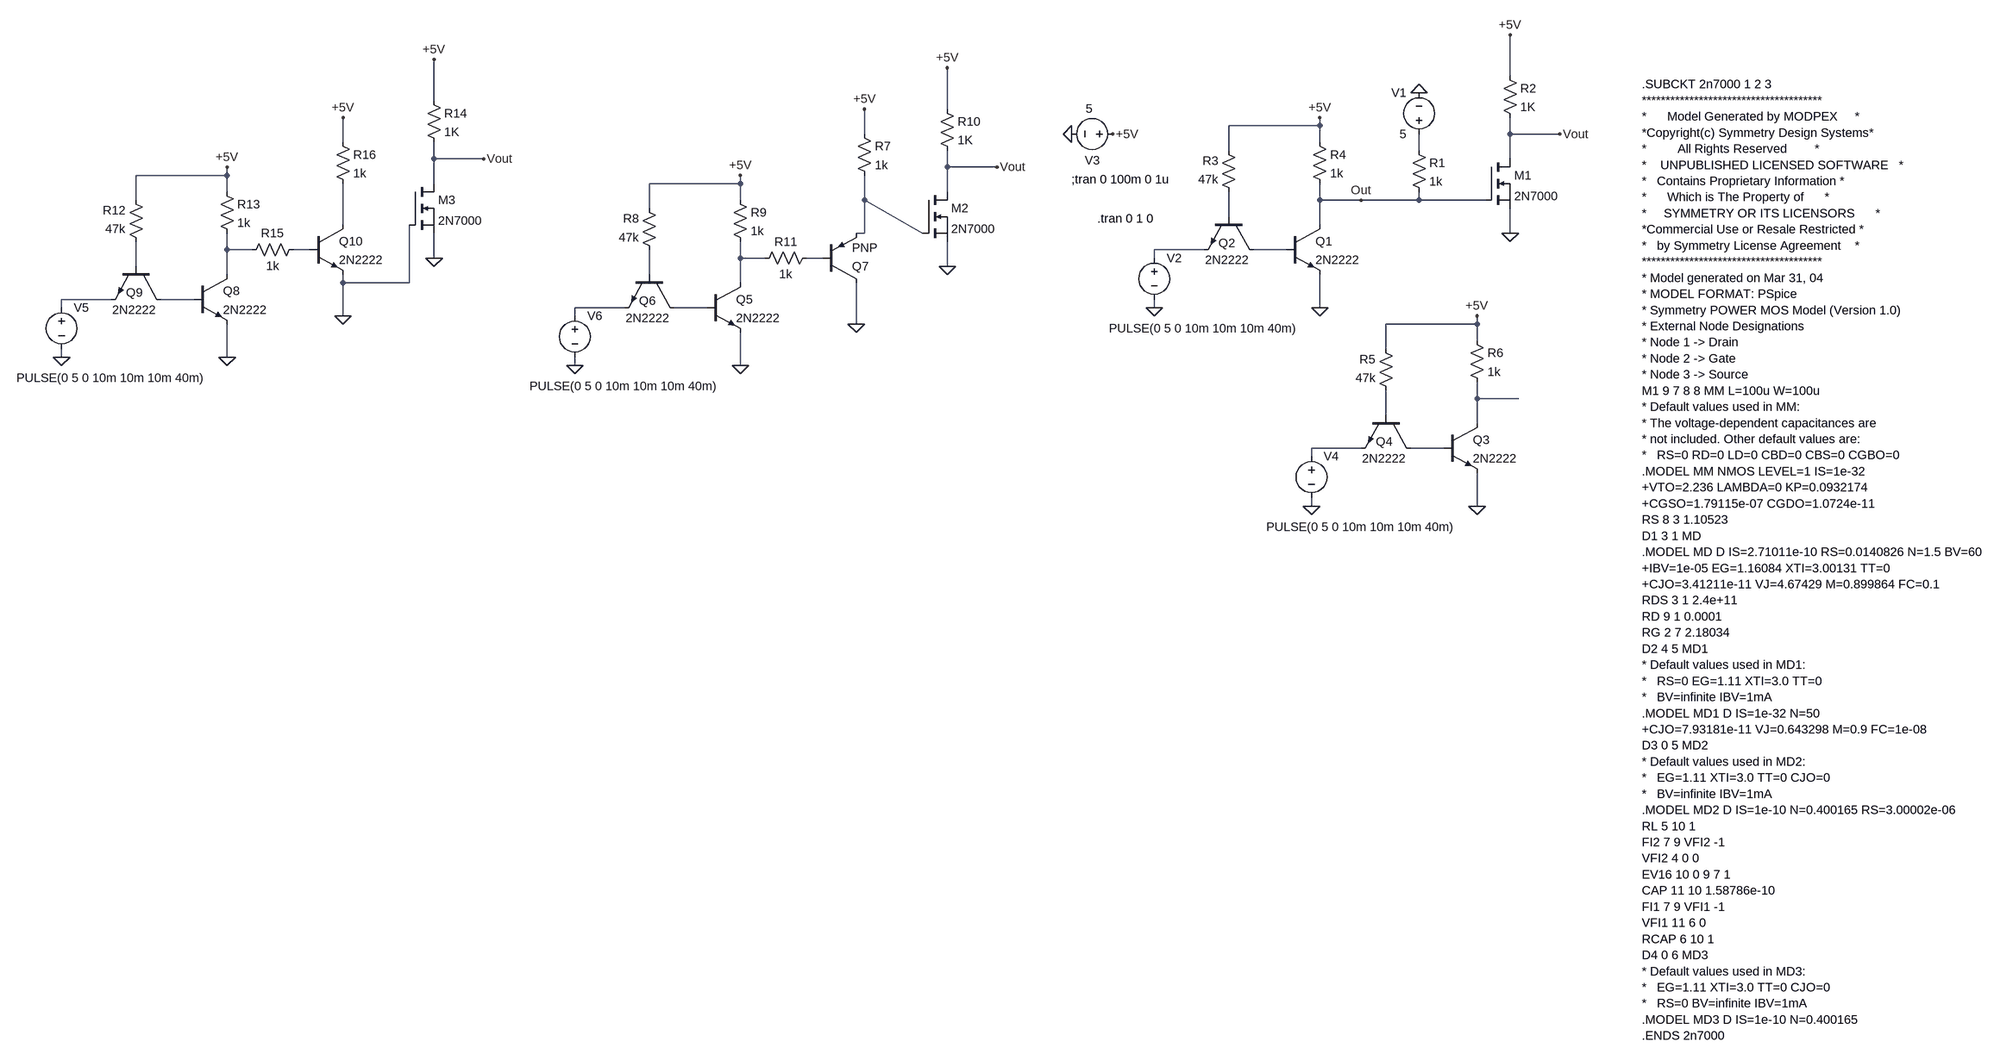
[diagram p0: schematic Soluciones.asc]
Soluciones.asc, the LTspice schematic file:
Version 4
SHEET 1 1320 1620
WIRE 336 -64 336 -144
WIRE -1744 -16 -1744 -96
WIRE -752 0 -752 -80
WIRE -32 32 -32 16
WIRE -32 32 -208 32
WIRE -912 48 -912 0
WIRE 336 48 336 16
WIRE 432 48 336 48
WIRE -1920 64 -1920 16
WIRE -32 64 -32 32
WIRE -208 80 -208 32
WIRE 160 80 160 48
WIRE -1744 96 -1744 64
WIRE -1648 96 -1744 96
WIRE 336 96 336 48
WIRE -752 112 -752 80
WIRE -656 112 -752 112
WIRE -2144 128 -2144 112
WIRE -2144 128 -2320 128
WIRE -1744 144 -1744 96
WIRE -1152 144 -1152 128
WIRE -1152 144 -1328 144
WIRE -2144 160 -2144 128
WIRE -752 160 -752 112
WIRE -2320 176 -2320 128
WIRE -1152 176 -1152 144
WIRE -912 176 -912 128
WIRE -32 176 -32 144
WIRE 48 176 -32 176
WIRE 160 176 160 160
WIRE 160 176 48 176
WIRE 288 176 160 176
WIRE -1328 192 -1328 144
WIRE -208 208 -208 160
WIRE -1920 224 -1920 144
WIRE -32 224 -32 176
WIRE -912 240 -912 176
WIRE -912 240 -928 240
WIRE -800 240 -912 176
WIRE 336 240 336 192
WIRE -2144 272 -2144 240
WIRE -2096 272 -2144 272
WIRE -1984 272 -2016 272
WIRE -256 272 -352 272
WIRE -96 272 -160 272
WIRE -1744 288 -1744 240
WIRE -1152 288 -1152 256
WIRE -1104 288 -1152 288
WIRE -992 288 -1024 288
WIRE -352 288 -352 272
WIRE -2320 304 -2320 256
WIRE -752 304 -752 256
WIRE -2144 320 -2144 272
WIRE -1328 320 -1328 272
WIRE -1920 336 -1920 320
WIRE -1792 336 -1792 224
WIRE -1792 336 -1920 336
WIRE -1152 336 -1152 288
WIRE -2368 368 -2464 368
WIRE -2208 368 -2272 368
WIRE -2464 384 -2464 368
WIRE -1376 384 -1472 384
WIRE -1216 384 -1280 384
WIRE -352 384 -352 368
WIRE -32 384 -32 320
WIRE -1920 400 -1920 336
WIRE -1472 400 -1472 384
WIRE -928 416 -928 336
WIRE 272 416 272 400
WIRE 272 416 96 416
WIRE 272 448 272 416
WIRE 96 464 96 416
WIRE -2464 480 -2464 464
WIRE -2144 480 -2144 416
WIRE -1472 496 -1472 480
WIRE -1152 496 -1152 432
WIRE 272 560 272 528
WIRE 352 560 272 560
WIRE 96 592 96 544
WIRE 272 608 272 560
WIRE 48 656 -48 656
WIRE 208 656 144 656
WIRE -48 672 -48 656
WIRE -48 768 -48 752
WIRE 272 768 272 704
FLAG 160 -32 0
FLAG 336 240 0
FLAG 336 -144 +5V
FLAG 432 48 Vout
FLAG -32 384 0
FLAG -32 16 +5V
FLAG 48 176 Out
FLAG -352 384 0
FLAG -512 48 0
FLAG -432 48 +5V
FLAG 272 768 0
FLAG 272 400 +5V
FLAG -48 768 0
FLAG -752 304 0
FLAG -656 112 Vout
FLAG -1152 496 0
FLAG -1152 128 +5V
FLAG -1472 496 0
FLAG -752 -80 +5V
FLAG -928 416 0
FLAG -912 0 +5V
FLAG -1744 288 0
FLAG -1648 96 Vout
FLAG -2144 480 0
FLAG -2144 112 +5V
FLAG -2464 480 0
FLAG -1744 -96 +5V
FLAG -1920 400 0
FLAG -1920 16 +5V
SYMBOL res 144 64 R0
SYMATTR InstName R1
SYMATTR Value 1k
SYMBOL voltage 160 64 R180
WINDOW 0 24 96 Left 2
WINDOW 3 24 16 Left 2
WINDOW 123 0 0 Left 0
WINDOW 39 0 0 Left 0
SYMATTR InstName V1
SYMATTR Value 5
SYMBOL nmos 288 96 R0
SYMATTR InstName M1
SYMATTR Value 2N7000
SYMATTR Prefix x
SYMBOL res 320 -80 R0
SYMATTR InstName R2
SYMATTR Value 1K
SYMBOL res -192 176 R180
WINDOW 0 36 76 Left 2
WINDOW 3 36 40 Left 2
SYMATTR InstName R3
SYMATTR Value 47k
SYMBOL npn -96 224 R0
SYMATTR InstName Q1
SYMATTR Value 2N2222
SYMBOL res -48 48 R0
SYMATTR InstName R4
SYMATTR Value 1k
SYMBOL voltage -352 272 R0
WINDOW 123 0 0 Left 0
WINDOW 39 0 0 Left 0
WINDOW 3 -87 152 Left 2
SYMATTR Value PULSE(0 5 0 10m 10m 10m 40m)
SYMATTR InstName V2
SYMBOL voltage -416 48 R90
WINDOW 123 0 0 Left 0
WINDOW 39 0 0 Left 0
WINDOW 0 51 41 VRight 2
WINDOW 3 -49 55 VRight 2
SYMATTR InstName V3
SYMATTR Value 5
SYMBOL npn -160 208 R90
WINDOW 0 51 35 VRight 2
WINDOW 3 84 9 VRight 2
SYMATTR InstName Q2
SYMATTR Value 2N2222
SYMBOL res 112 560 R180
WINDOW 0 36 76 Left 2
WINDOW 3 36 40 Left 2
SYMATTR InstName R5
SYMATTR Value 47k
SYMBOL npn 208 608 R0
SYMATTR InstName Q3
SYMATTR Value 2N2222
SYMBOL res 256 432 R0
SYMATTR InstName R6
SYMATTR Value 1k
SYMBOL voltage -48 656 R0
WINDOW 123 0 0 Left 0
WINDOW 39 0 0 Left 0
WINDOW 3 -87 152 Left 2
SYMATTR Value PULSE(0 5 0 10m 10m 10m 40m)
SYMATTR InstName V4
SYMBOL npn 144 592 R90
WINDOW 0 51 35 VRight 2
WINDOW 3 84 9 VRight 2
SYMATTR InstName Q4
SYMATTR Value 2N2222
SYMBOL nmos -800 160 R0
SYMATTR InstName M2
SYMATTR Value 2N7000
SYMATTR Prefix x
SYMBOL res -1312 288 R180
WINDOW 0 36 76 Left 2
WINDOW 3 36 40 Left 2
SYMATTR InstName R8
SYMATTR Value 47k
SYMBOL npn -1216 336 R0
SYMATTR InstName Q5
SYMATTR Value 2N2222
SYMBOL res -1168 160 R0
SYMATTR InstName R9
SYMATTR Value 1k
SYMBOL voltage -1472 384 R0
WINDOW 123 0 0 Left 0
WINDOW 39 0 0 Left 0
WINDOW 3 -87 152 Left 2
SYMATTR Value PULSE(0 5 0 10m 10m 10m 40m)
SYMATTR InstName V6
SYMBOL npn -1280 320 R90
WINDOW 0 51 35 VRight 2
WINDOW 3 84 9 VRight 2
SYMATTR InstName Q6
SYMATTR Value 2N2222
SYMBOL res -768 -16 R0
SYMATTR InstName R10
SYMATTR Value 1K
SYMBOL pnp -992 336 M180
SYMATTR InstName Q7
SYMBOL res -1008 272 R90
WINDOW 0 0 56 VBottom 2
WINDOW 3 32 56 VTop 2
SYMATTR InstName R11
SYMATTR Value 1k
SYMBOL res -928 32 R0
SYMATTR InstName R7
SYMATTR Value 1k
SYMBOL nmos -1792 144 R0
SYMATTR InstName M3
SYMATTR Value 2N7000
SYMATTR Prefix x
SYMBOL res -2304 272 R180
WINDOW 0 36 76 Left 2
WINDOW 3 36 40 Left 2
SYMATTR InstName R12
SYMATTR Value 47k
SYMBOL npn -2208 320 R0
SYMATTR InstName Q8
SYMATTR Value 2N2222
SYMBOL res -2160 144 R0
SYMATTR InstName R13
SYMATTR Value 1k
SYMBOL voltage -2464 368 R0
WINDOW 123 0 0 Left 0
WINDOW 39 0 0 Left 0
WINDOW 3 -87 152 Left 2
SYMATTR Value PULSE(0 5 0 10m 10m 10m 40m)
SYMATTR InstName V5
SYMBOL npn -2272 304 R90
WINDOW 0 51 35 VRight 2
WINDOW 3 84 9 VRight 2
SYMATTR InstName Q9
SYMATTR Value 2N2222
SYMBOL res -1760 -32 R0
SYMATTR InstName R14
SYMATTR Value 1K
SYMBOL res -2000 256 R90
WINDOW 0 0 56 VBottom 2
WINDOW 3 32 56 VTop 2
SYMATTR InstName R15
SYMATTR Value 1k
SYMBOL res -1936 48 R0
SYMATTR InstName R16
SYMATTR Value 1k
SYMBOL npn -1984 224 R0
SYMATTR InstName Q10
SYMATTR Value 2N2222
TEXT -462 212 Left 2 !.tran 0 1 0
TEXT 664 -48 Left 2 !.SUBCKT 2n7000 1 2 3\n**************************************\n*      Model Generated by MODPEX     *\n*Copyright(c) Symmetry Design Systems*\n*         All Rights Reserved        *\n*    UNPUBLISHED LICENSED SOFTWARE   *\n*   Contains Proprietary Information *\n*      Which is The Property of      *\n*     SYMMETRY OR ITS LICENSORS      *\n*Commercial Use or Resale Restricted *\n*   by Symmetry License Agreement    *\n**************************************\n* Model generated on Mar 31, 04\n* MODEL FORMAT: PSpice\n* Symmetry POWER MOS Model (Version 1.0)\n* External Node Designations\n* Node 1 -> Drain\n* Node 2 -> Gate\n* Node 3 -> Source\nM1 9 7 8 8 MM L=100u W=100u\n* Default values used in MM:\n* The voltage-dependent capacitances are\n* not included. Other default values are:\n*   RS=0 RD=0 LD=0 CBD=0 CBS=0 CGBO=0\n.MODEL MM NMOS LEVEL=1 IS=1e-32\n+VTO=2.236 LAMBDA=0 KP=0.0932174\n+CGSO=1.79115e-07 CGDO=1.0724e-11\nRS 8 3 1.10523\nD1 3 1 MD\n.MODEL MD D IS=2.71011e-10 RS=0.0140826 N=1.5 BV=60\n+IBV=1e-05 EG=1.16084 XTI=3.00131 TT=0\n+CJO=3.41211e-11 VJ=4.67429 M=0.899864 FC=0.1\nRDS 3 1 2.4e+11\nRD 9 1 0.0001\nRG 2 7 2.18034\nD2 4 5 MD1\n* Default values used in MD1:\n*   RS=0 EG=1.11 XTI=3.0 TT=0\n*   BV=infinite IBV=1mA\n.MODEL MD1 D IS=1e-32 N=50\n+CJO=7.93181e-11 VJ=0.643298 M=0.9 FC=1e-08\nD3 0 5 MD2\n* Default values used in MD2:\n*   EG=1.11 XTI=3.0 TT=0 CJO=0\n*   BV=infinite IBV=1mA\n.MODEL MD2 D IS=1e-10 N=0.400165 RS=3.00002e-06\nRL 5 10 1\nFI2 7 9 VFI2 -1\nVFI2 4 0 0\nEV16 10 0 9 7 1\nCAP 11 10 1.58786e-10\nFI1 7 9 VFI1 -1\nVFI1 11 6 0\nRCAP 6 10 1\nD4 0 6 MD3\n* Default values used in MD3:\n*   EG=1.11 XTI=3.0 TT=0 CJO=0\n*   RS=0 BV=infinite IBV=1mA\n.MODEL MD3 D IS=1e-10 N=0.400165\n.ENDS 2n7000
TEXT -512 136 Left 2 !;tran 0 100m 0 1u

The netlist it stands for:
* Soluciones.asc
R1 N001 Out 1k
V1 N001 0 5
XM1 Vout Out 0 2N7000  ; pins D G S
R2 +5V Vout 1K
R3 N003 +5V 47k
Q1 Out N008 0 0 2N2222
R4 +5V Out 1k
V2 N007 0 PULSE(0 5 0 10m 10m 10m 40m)
V3 +5V 0 5
Q2 N008 N003 N007 0 2N2222
R5 N018 +5V 47k
Q3 N017 N020 0 0 2N2222
R6 +5V N017 1k
V4 N019 0 PULSE(0 5 0 10m 10m 10m 40m)
Q4 N020 N018 N019 0 2N2222
XM2 Vout N002 0 2N7000  ; pins D G S
R8 N012 +5V 47k
Q5 N009 N016 0 0 2N2222
R9 +5V N009 1k
V6 N015 0 PULSE(0 5 0 10m 10m 10m 40m)
Q6 N016 N012 N015 0 2N2222
R10 +5V Vout 1K
Q7 0 N010 N002 0 PNP
R11 N010 N009 1k
R7 +5V N002 1k
XM3 Vout 0 0 2N7000  ; pins D G S
R12 N011 +5V 47k
Q8 N005 N014 0 0 2N2222
R13 +5V N005 1k
V5 N013 0 PULSE(0 5 0 10m 10m 10m 40m)
Q9 N014 N011 N013 0 2N2222
R14 +5V Vout 1K
R15 N006 N005 1k
R16 +5V N004 1k
Q10 N004 N006 0 0 2N2222
.model NPN NPN
.model PNP PNP
.lib standard.bjt
.tran 0 1 0
.SUBCKT 2n7000 1 2 3
**************************************
*      Model Generated by MODPEX     *
*Copyright(c) Symmetry Design Systems*
*         All Rights Reserved        *
*    UNPUBLISHED LICENSED SOFTWARE   *
*   Contains Proprietary Information *
*      Which is The Property of      *
*     SYMMETRY OR ITS LICENSORS      *
*Commercial Use or Resale Restricted *
*   by Symmetry License Agreement    *
**************************************
* Model generated on Mar 31, 04
* MODEL FORMAT: PSpice
* Symmetry POWER MOS Model (Version 1.0)
* External Node Designations
* Node 1 -> Drain
* Node 2 -> Gate
* Node 3 -> Source
M1 9 7 8 8 MM L=100u W=100u
* Default values used in MM:
* The voltage-dependent capacitances are
* not included. Other default values are:
*   RS=0 RD=0 LD=0 CBD=0 CBS=0 CGBO=0
.MODEL MM NMOS LEVEL=1 IS=1e-32
+VTO=2.236 LAMBDA=0 KP=0.0932174
+CGSO=1.79115e-07 CGDO=1.0724e-11
RS 8 3 1.10523
D1 3 1 MD
.MODEL MD D IS=2.71011e-10 RS=0.0140826 N=1.5 BV=60
+IBV=1e-05 EG=1.16084 XTI=3.00131 TT=0
+CJO=3.41211e-11 VJ=4.67429 M=0.899864 FC=0.1
RDS 3 1 2.4e+11
RD 9 1 0.0001
RG 2 7 2.18034
D2 4 5 MD1
* Default values used in MD1:
*   RS=0 EG=1.11 XTI=3.0 TT=0
*   BV=infinite IBV=1mA
.MODEL MD1 D IS=1e-32 N=50
+CJO=7.93181e-11 VJ=0.643298 M=0.9 FC=1e-08
D3 0 5 MD2
* Default values used in MD2:
*   EG=1.11 XTI=3.0 TT=0 CJO=0
*   BV=infinite IBV=1mA
.MODEL MD2 D IS=1e-10 N=0.400165 RS=3.00002e-06
RL 5 10 1
FI2 7 9 VFI2 -1
VFI2 4 0 0
EV16 10 0 9 7 1
CAP 11 10 1.58786e-10
FI1 7 9 VFI1 -1
VFI1 11 6 0
RCAP 6 10 1
D4 0 6 MD3
* Default values used in MD3:
*   EG=1.11 XTI=3.0 TT=0 CJO=0
*   RS=0 BV=infinite IBV=1mA
.MODEL MD3 D IS=1e-10 N=0.400165
.ENDS 2n7000
;tran 0 100m 0 1u
.backanno
.end